# Altium schematic sheet 03-LP Filter.SchDoc
size 246 x 182 mm
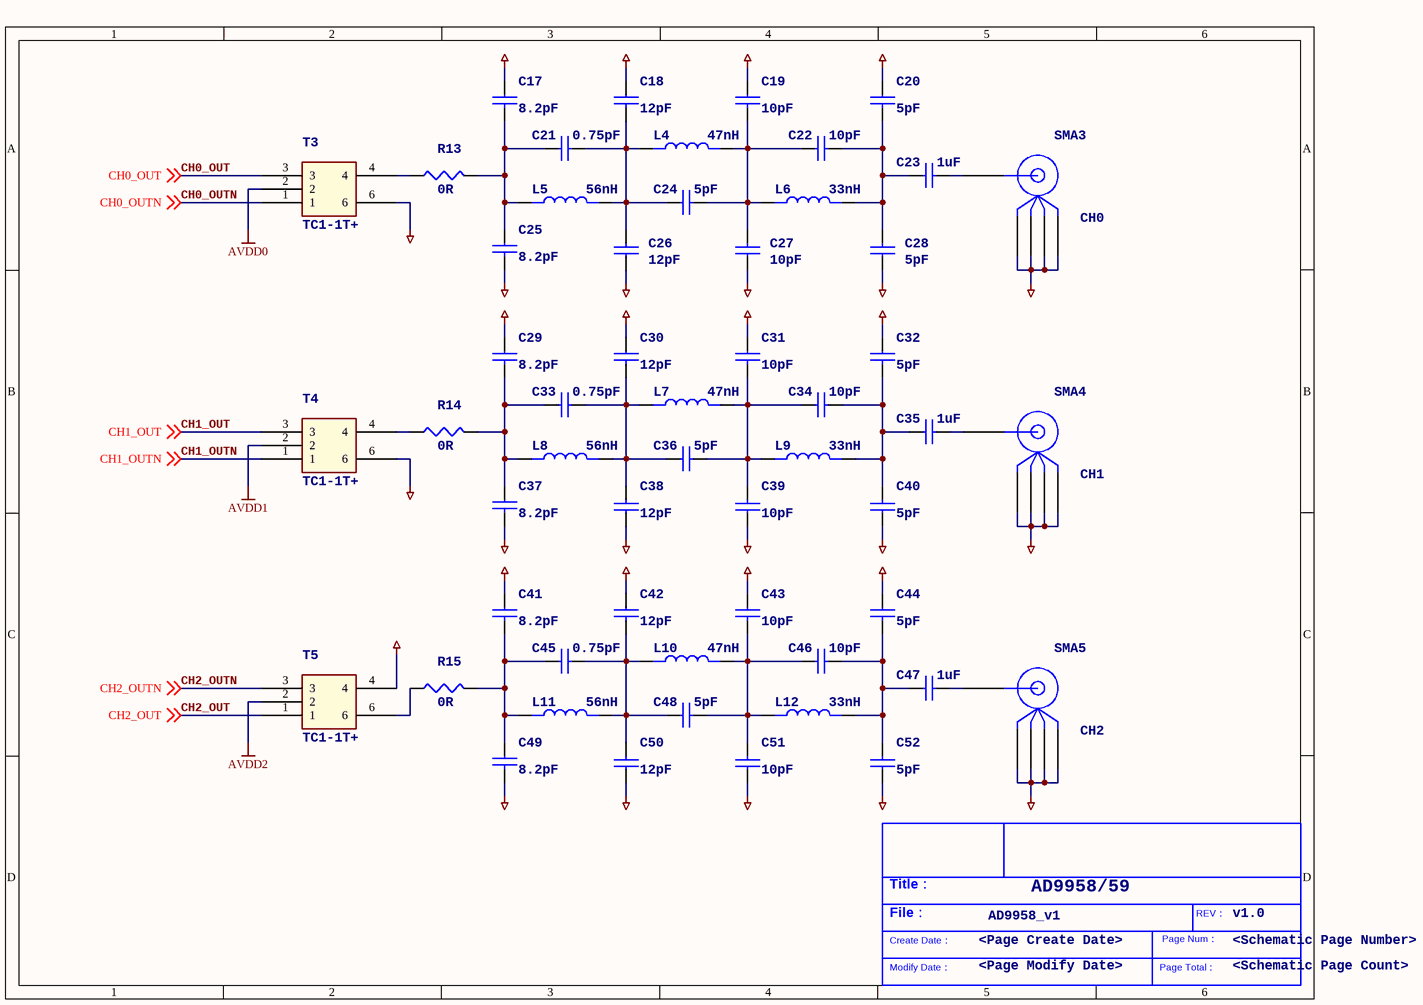
[diagram p0: 03-LP Filter.SchDoc]

## Parts
*  Schematic Page Count: <Schematic Page Count>  Schematic Page Number: <Schematic Page Number>  Page Modify Date: <Page Modify Date>  Page Create Date: <Page Create Date>  Revcode: v1.0  File: AD9958_v1  Title: AD9958/59  (hidden comment: My_Title_Block)  (graphical)
C17  8.2pF  [0603C]
C18  12pF  [0603C]
C19  10pF  [0603C]
C20  5pF  [0603C]
C21  0.75pF  [0603C]
C22  10pF  [0603C]
C23  1uF  [0603C]
C24  5pF  [0603C]
C25  8.2pF  [0603C]
C26  12pF  [0603C]
C27  10pF  [0603C]
C28  5pF  [0603C]
C29  8.2pF  [0603C]
C30  12pF  [0603C]
C31  10pF  [0603C]
C32  5pF  [0603C]
C33  0.75pF  [0603C]
C34  10pF  [0603C]
C35  1uF  [0603C]
C36  5pF  [0603C]
C37  8.2pF  [0603C]
C38  12pF  [0603C]
C39  10pF  [0603C]
C40  5pF  [0603C]
C41  8.2pF  [0603C]
C42  12pF  [0603C]
C43  10pF  [0603C]
C44  5pF  [0603C]
C45  0.75pF  [0603C]
C46  10pF  [0603C]
C47  1uF  [0603C]
C48  5pF  [0603C]
C49  8.2pF  [0603C]
C50  12pF  [0603C]
C51  10pF  [0603C]
C52  5pF  [0603C]
L4  47nH  [0603L]
L5  56nH  [0603L]
L6  33nH  [0603L]
L7  47nH  [0603L]
L8  56nH  [0603L]
L9  33nH  [0603L]
L10  47nH  [0603L]
L11  56nH  [0603L]
L12  33nH  [0603L]
R13  0R  [0603R]
R14  0R  [0603R]
R15  0R  [0603R]
SMA3  CH0  [SMA-SMD]
SMA4  CH1  [SMA-SMD]
SMA5  CH2  [SMA-SMD]
T3  TC1-1T+  [at224-1a]
T4  TC1-1T+  [at224-1a]
T5  TC1-1T+  [at224-1a]

## Nets
AGND: C17.1 C18.1 C19.1 C20.1 C25.2 C26.1 C27.1 C28.1 C29.1 C30.1 C31.1 C32.1 C37.2 C38.1 C39.1 C40.1 C41.1 C42.1 C43.1 C44.1 C49.2 C50.1 C51.1 C52.1 SMA3.2(GND) SMA3.3(GND) SMA3.4(GND) SMA3.5(GND) SMA4.2(GND) SMA4.3(GND) SMA4.4(GND) SMA4.5(GND) SMA5.2(GND) SMA5.3(GND) SMA5.4(GND) SMA5.5(GND) T3.6 T4.6 T5.4
AVDD0: T3.2
AVDD1: T4.2
AVDD2: T5.2
CH0_OUT: T3.3 ; off-sheet CH0_OUT
CH0_OUTN: T3.1 ; off-sheet CH0_OUTN
CH1_OUT: T4.3 ; off-sheet CH1_OUT
CH1_OUTN: T4.1 ; off-sheet CH1_OUTN
CH2_OUT: T5.1 ; off-sheet CH2_OUT
CH2_OUTN: T5.3 ; off-sheet CH2_OUTN
NetC17_2: C17.2 C21.1 C25.1 L5.1 R13.2
NetC18_2: C18.2 C21.2 C24.1 C26.2 L4.1 L5.2
NetC19_2: C19.2 C22.1 C24.2 C27.2 L4.2 L6.1
NetC20_2: C20.2 C22.2 C23.1 C28.2 L6.2
NetC23_2: C23.2 SMA3.1
NetC29_2: C29.2 C33.1 C37.1 L8.1 R14.2
NetC30_2: C30.2 C33.2 C36.1 C38.2 L7.1 L8.2
NetC31_2: C31.2 C34.1 C36.2 C39.2 L7.2 L9.1
NetC32_2: C32.2 C34.2 C35.1 C40.2 L9.2
NetC35_2: C35.2 SMA4.1
NetC41_2: C41.2 C45.1 C49.1 L11.1 R15.2
NetC42_2: C42.2 C45.2 C48.1 C50.2 L10.1 L11.2
NetC43_2: C43.2 C46.1 C48.2 C51.2 L10.2 L12.1
NetC44_2: C44.2 C46.2 C47.1 C52.2 L12.2
NetC47_2: C47.2 SMA5.1
NetR13_1: R13.1 T3.4
NetR14_1: R14.1 T4.4
NetR15_1: R15.1 T5.6

## Notes on the sheet
- (in symbol My_Title_Block) Title：; REV：; File：; Create Date：; Page Num：; Modify Date：; Page Total：

## Library data of the parts
* = My_Title_Block: Company Name: 东莞理工学院; Page Count: 4; Page Number: 3
C17-C52 = CAP NP
L4-L12 = INDUCTANCE
R13-R15 = R
SMA3-SMA5 = BNC